# Altium schematic sheet Sheet.SchDoc
size A4
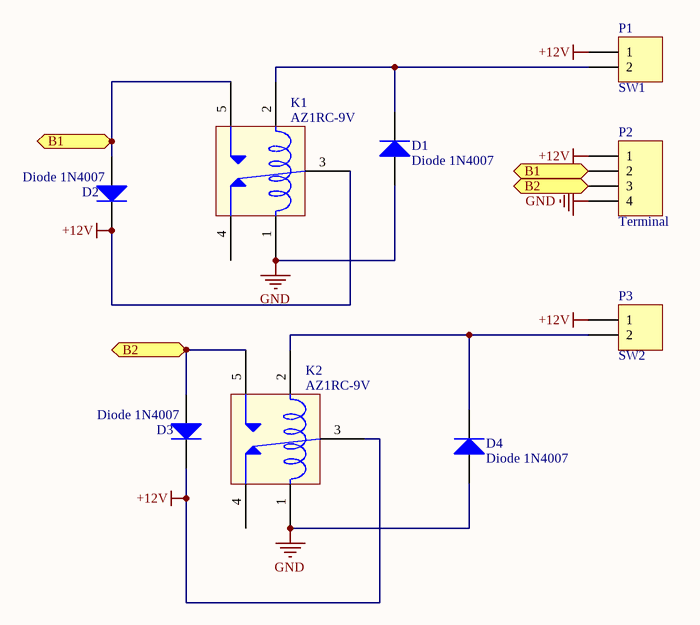
[diagram p0: Sheet.SchDoc]

## Parts
D1  Diode 1N4007  [DO-41]
D2  Diode 1N4007  [DO-41]
D3  Diode 1N4007  [DO-41]
D4  Diode 1N4007  [DO-41]
K1  AZ1RC-9V  [Relay-A]
K2  AZ1RC-9V  [Relay-A]
P1  SW1  [KRE_2]
P2  Terminal  [KRE_4]
P3  SW2  [KRE_2]

## Ports
B1 (in), B1 (out), B2 (in), B2 (out)

## Nets
+12V: D2.2(K) D3.2(K) K1.3 K2.3 P1.1 P2.1 P3.1
GND: D1.1(A) D4.1(A) K1.1 K2.1 P2.4
B1: D2.1(A) K1.5 P2.2 ; port B1
B2: D3.1(A) K2.5 P2.3 ; port B2
NetD1_2: D1.2(K) K1.2 P1.2
NetD4_2: D4.2(K) K2.2 P3.2

Not connected (* = marked no-connect by the designer): K1 4; K2 4

## Library data of the parts
D1-D4 = Diode 1N4007: 1 Amp General Purpose Rectifier; Published: 8-Jun-2000; LatestRevisionDate: 17-Jul-2002; LatestRevisionNote: Re-released for DXP Platform.; DatasheetVersion: 1998; PackageVersion: Aug-1999; PackageReference: DO-41; Publisher: Altium Limited; PackageDescription: Diode, Axial; Body 5.2 x 2.7 mm (LxDia. max), Lead Dia. 0.86 mm (max); Code_JEDEC: DO-204-AL; ComponentLink1Description: Manufacturer Link; ComponentLink1URL: http://www.fairchildsemi.com/; ComponentLink2Description: Datasheet; ComponentLink2URL: http://www.fairchildsemi.com/ds/1N%2F1N4001.pdf
K1 K2 = AZ1RC-9V: Miniature Relay, 10 A, 9 Vdc, 250 Vac; Maximum Switching Voltage (AC): 250 V; Maximum Switching Voltage (DC): 30 V; Maximum Switching Current: 10 A; Coil Nominal Voltage (DC): 9 V
P1 P3 = KRE_2: Terminal Block 1x2
P2 = KRE_4: Terminal Block 1x4